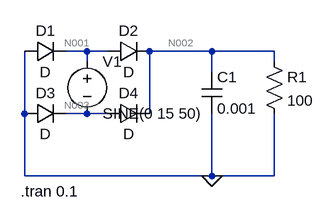
[diagram p0: schematic Bridge_Rectifier.asc]
Bridge_Rectifier.asc, the LTspice schematic file:
Version 4
SHEET 1 880 680
WIRE 192 80 160 80
WIRE 224 80 192 80
WIRE 384 80 288 80
WIRE 480 80 384 80
WIRE 192 96 192 80
WIRE 480 96 480 80
WIRE 384 112 384 80
WIRE 96 176 96 80
WIRE 192 176 160 176
WIRE 224 176 192 176
WIRE 288 176 288 80
WIRE 96 272 96 176
WIRE 384 272 384 176
WIRE 384 272 96 272
WIRE 480 272 480 176
WIRE 480 272 384 272
FLAG 384 272 0
SYMBOL diode 96 96 R270
WINDOW 0 32 32 VTop 2
WINDOW 3 0 32 VBottom 2
SYMATTR InstName D1
SYMBOL diode 224 96 R270
WINDOW 0 32 32 VTop 2
WINDOW 3 0 32 VBottom 2
SYMATTR InstName D2
SYMBOL diode 96 192 R270
WINDOW 0 32 32 VTop 2
WINDOW 3 0 32 VBottom 2
SYMATTR InstName D3
SYMBOL diode 224 192 R270
WINDOW 0 32 32 VTop 2
WINDOW 3 0 32 VBottom 2
SYMATTR InstName D4
SYMBOL voltage 192 80 R0
WINDOW 123 0 0 Left 2
WINDOW 39 0 0 Left 2
SYMATTR InstName V1
SYMATTR Value SINE(0 15 50)
SYMBOL cap 368 112 R0
SYMATTR InstName C1
SYMATTR Value 0.001
SYMBOL res 464 80 R0
SYMATTR InstName R1
SYMATTR Value 100
TEXT 90 296 Left 2 !.tran 0.1

The netlist it stands for:
* Bridge_Rectifier.asc
D1 0 N001 D
D2 N001 N002 D
D3 0 N003 D
D4 N003 N002 D
V1 N001 N003 SINE(0 15 50)
C1 N002 0 0.001
R1 N002 0 100
.model D D
.lib standard.dio
.tran 0.1
.backanno
.end

* Results of the author's LTspice run, read from the files saved beside the schematic
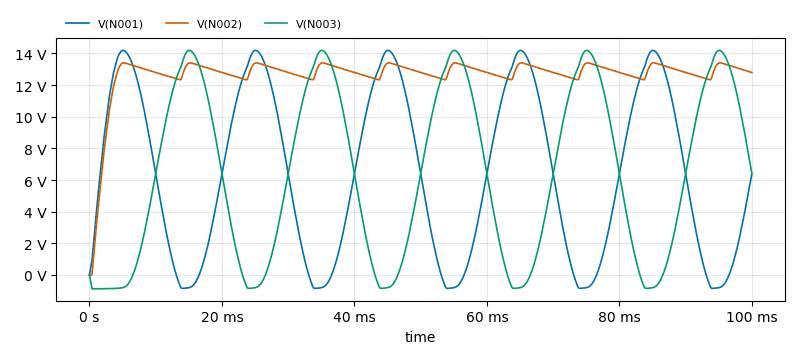
[diagram p1: Transient Analysis of Bridge_Rectifier.asc, plotted from the saved traces]
* Transient Analysis, 1 run:
*   V(N001): min -846 mV, max 14.2 V, average 6.325 V, rms 8.261 V, last 6.399 V
*   V(N002): min 0 V, max 13.41 V, average 12.65 V, rms 12.74 V, last 12.8 V
*   V(N003): min -873.6 mV, max 14.2 V, average 6.326 V, rms 8.335 V, last 6.399 V